# Altium project Kocka_V3.1_ESP.PrjPcb
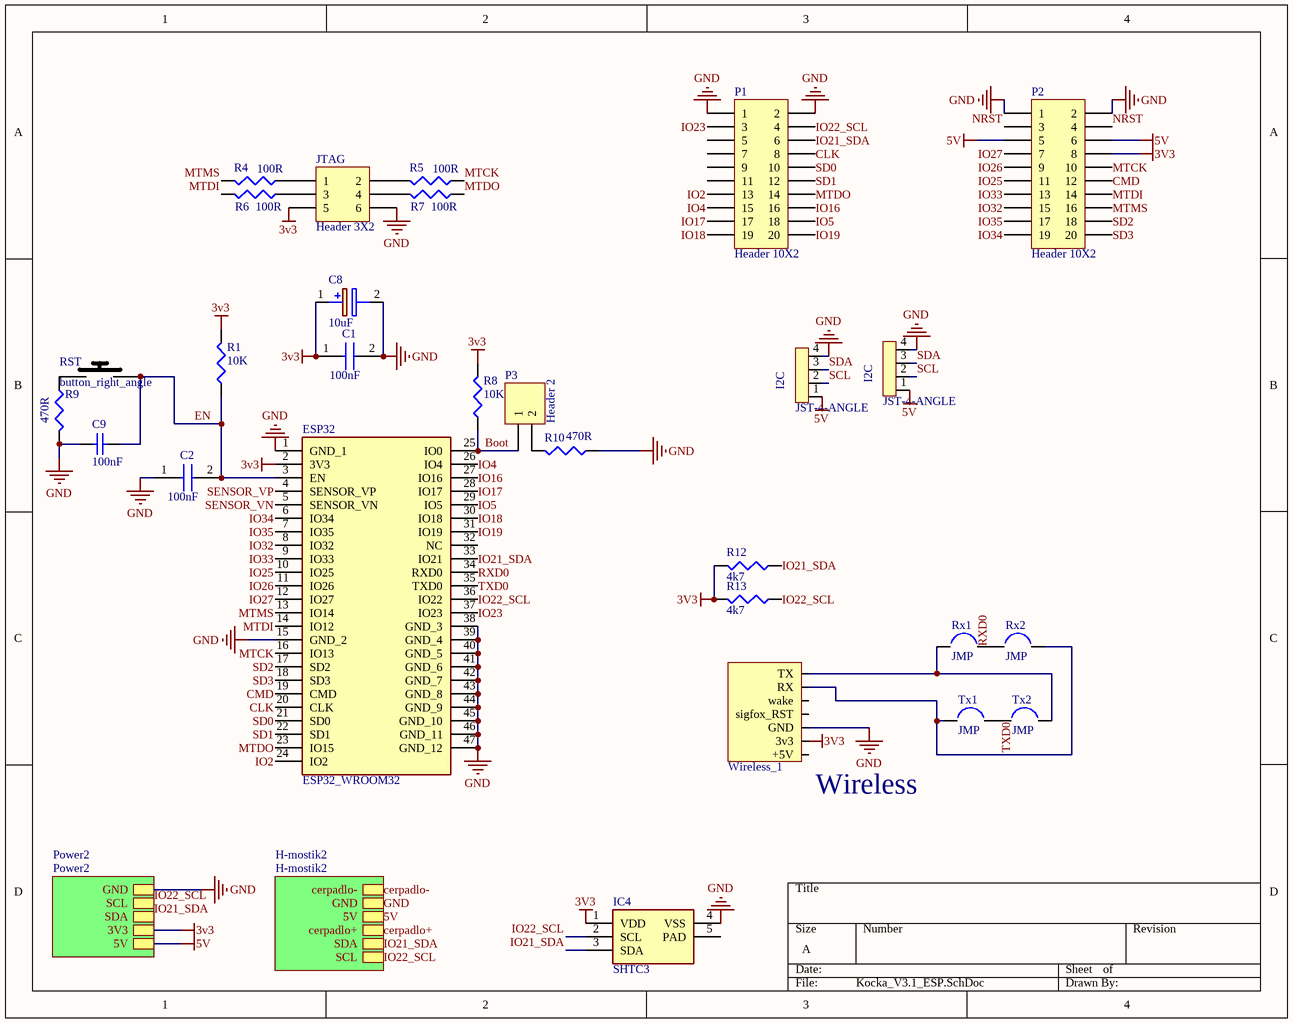
[diagram p0: Kocka_V3.1_ESP.SchDoc]
3 sheets, 53 parts. Net scope: hierarchical (ports join the sheet entries above them; power ports are global).
Board files: Kocka_V3.1_ESP.PcbDoc, Kocka_V3.1_ESP_panel.PcbDoc
Sheets:
  Kocka_V3.1_ESP.SchDoc
    H-mostik2 = H-mostik2.SchDoc
    Power2 = Power2.SchDoc

## Sheet Kocka_V3.1_ESP.SchDoc
size A

### Parts
(Parts that share a designator on the sheet are numbered #1, #2 ... from top to bottom, then left to right.)
C1  100nF  [CAPC1608X90N]
C2  100nF  [CAPC1608X90N]
C8  10uF  [CAPPM3216X180N]
C9  100nF  [1608[0603]]
ESP32  ESP32_WROOM32  [ESP32WROOM32]
I2C#1  JST-4-ANGLE  [JST-4-ANGLE]
I2C#2  JST-4-ANGLE  [JST-4-ANGLE]
IC4  SHTC3  [SHTC3]
JTAG  Header 3X2  [HDR2X3]
P1  Header 10X2  [HDR2X10]
P2  Header 10X2  [HDR2X10]
P3  Header 2  [HDR1X2]
R1  10K  [J1-0603]
R4  100R  [J1-0603]
R5  100R  [J1-0603]
R6  100R  [J1-0603]
R7  100R  [J1-0603]
R8  10K  [J1-0603]
R9  470R  [J1-0603]
R10  470R  [J1-0603]
R12  4k7  [J1-0603]
R13  4k7  [J1-0603]
RST  button_right_angle  [1825027-8]
Rx1  JMP  [JMP]
Rx2  JMP  [JMP]
Tx1  JMP  [JMP]
Tx2  JMP  [JMP]
Wireless_1  header7  [Wireless]  (value not drawn)

### Sub-sheets
H-mostik2 = H-mostik2: 5V, SCL, GND, SDA, cerpadlo+, cerpadlo-
Power2 = Power2: 3V3, SCL, SDA, 5V, GND

### Nets
3v3: C1.1 C8.1(+) ESP32.2(3V3) IC4.1(VDD) JTAG.5 P2.8 R1.2 R8.2 R12.2 R13.2 Wireless_1.2(3v3) ; sheet Power2/3V3
5V: I2C#1.1 I2C#2.1 P2.5 P2.6 ; sheet H-mostik2/5V, sheet Power2/5V
GND: C1.2 C2.1 C8.2(-) C9.1 ESP32.1(GND_1) ESP32.15(GND_2) ESP32.38(GND_3) ESP32.39(GND_4) ESP32.40(GND_5) ESP32.41(GND_6) ESP32.42(GND_7) ESP32.43(GND_8) ESP32.44(GND_9) ESP32.45(GND_10) ESP32.46(GND_11) ESP32.47(GND_12) I2C#1.4 I2C#2.4 IC4.4(VSS) JTAG.6 P1.1 P1.2 P2.1 P2.2 R9.2 R10.1 Wireless_1.3(GND) ; sheet H-mostik2/GND, sheet Power2/GND
Boot: ESP32.25(IO0) P3.1 R8.1
CLK: ESP32.20(CLK) P1.8
CMD: ESP32.19(CMD) P2.12
EN: C2.2 C9.2 ESP32.3(EN) R1.1 RST.2
IO2: ESP32.24(IO2) P1.13
IO4: ESP32.26(IO4) P1.15
IO5: ESP32.29(IO5) P1.18
IO16: ESP32.27(IO16) P1.16
IO17: ESP32.28(IO17) P1.17
IO18: ESP32.30(IO18) P1.19
IO19: ESP32.31(IO19) P1.20
IO21_SDA: ESP32.33(IO21) IC4.3(SDA) P1.6 R12.1 ; sheet H-mostik2/SDA, sheet Power2/SDA
IO22_SCL: ESP32.36(IO22) IC4.2(SCL) P1.4 R13.1 ; sheet H-mostik2/SCL, sheet Power2/SCL
IO23: ESP32.37(IO23) P1.3
IO25: ESP32.10(IO25) P2.11
IO26: ESP32.11(IO26) P2.9
IO27: ESP32.12(IO27) P2.7
IO32: ESP32.8(IO32) P2.15
IO33: ESP32.9(IO33) P2.13
IO34: ESP32.6(IO34) P2.19
IO35: ESP32.7(IO35) P2.17
MTCK: ESP32.16(IO13) P2.10 R5.1
MTDI: ESP32.14(IO12) P2.14 R6.2
MTDO: ESP32.23(IO15) P1.14 R7.1
MTMS: ESP32.13(IO14) P2.16 R4.2
NRST: P2.3 P2.4
RXD0: ESP32.34(RXD0) Rx1.2 Rx2.1
SCL: I2C#1.2 I2C#2.2
SD0: ESP32.21(SD0) P1.10
SD1: ESP32.22(SD1) P1.12
SD2: ESP32.17(SD2) P2.18
SD3: ESP32.18(SD3) P2.20
SDA: I2C#1.3 I2C#2.3
SENSOR_VN: ESP32.5(SENSOR_VN)
SENSOR_VP: ESP32.4(SENSOR_VP)
TXD0: ESP32.35(TXD0) Tx1.2 Tx2.1
NetJTAG_1: JTAG.1 R4.1
NetJTAG_2: JTAG.2 R5.2
NetJTAG_3: JTAG.3 R6.1
NetJTAG_4: JTAG.4 R7.2
NetP3_2: P3.2 R10.2
NetR9_1: R9.1 RST.1
NetRx1_1: Rx1.1 Tx2.2 Wireless_1.7(TX)
NetRx2_2: Rx2.2 Tx1.1 Wireless_1.6(RX)

Not connected (* = marked no-connect by the designer): ESP32 32(NC); IC4 5(PAD); P1 5 7 9 11; Wireless_1 1(+5V) 4(sigfox_RST) 5(wake)

### Notes on the sheet
- (near Wireless_1) Wireless

### Library data of the parts
C1 C2 = 06033D225MAT2A: Capacitor; Manufacturer_Name: AVX; Datasheet Link: https://componentsearchengine.com/Datasheets/1/06031A100FAT2A.pdf; Height: 0.9mm; Manufacturer_Part_Number: 06033D225MAT2A; Mouser Part Number: 581-06033D225MAT2A; Mouser Price/Stock: https://www.mouser.co.uk/ProductDetail/AVX/06033D225MAT2A?qs=%252BdQmOuGyFcGllV0VA4zyxA%3D%3D
C8 = TAJA106K004RNJ: Capacitor Polarised; Manufacturer_Name: AVX; Datasheet Link: http://www.farnell.com/datasheets/1680476.pdf; Height: 1.8mm; Manufacturer_Part_Number: TAJA106K004RNJ; Mouser Part Number: 581-TAJA106K004R; Mouser Price/Stock: https://www.mouser.com/Search/Refine.aspx?Keyword=581-TAJA106K004R
C9 = Cap Semi: Capacitor; Value: 100pF; Published: 8-Jun-2000; LatestRevisionDate: 29-May-2009; LatestRevisionNote: IPC-7351 Footprint Added.; PackageReference: C1206; Publisher: Altium Limited; PackageDescription: Chip Capacitor
ESP32 = ESP32_WROOM32: Integrated Circuit; Manufacturer_Name: Espressif Systems; Manufacturer_Part_Number: ESP32 WROOM32; Datasheet Link: https://www.espressif.com/sites/default/files/documentation/esp32-wroom-32_datasheet_en.pdf; Height: 3.2mm
I2C#1 I2C#2 = JST-4-ANGLE: NXW-04K
IC4 = SHTC3: Integrated Circuit; Manufacturer_Name: Sensirion; Datasheet Link: https://www.glynshop.com/erp/owweb/Daten/Datenblaetter/Sensirion/SHTC3.pdf; Height: 0mm; Manufacturer_Part_Number: SHTC3; Mouser Part Number: 403-SHTC3; Mouser Price/Stock: https://www.mouser.com/Search/Refine.aspx?Keyword=403-SHTC3
JTAG = Header 3X2: Header, 3-Pin, Dual row; LatestRevisionDate: 17-Jul-2002; LatestRevisionNote: Re-released for DXP Platform.; Publisher: Altium Limited
P1 P2 = Header 10X2: Header, 10-Pin, Dual row; LatestRevisionDate: 17-Jul-2002; LatestRevisionNote: Re-released for DXP Platform.; Publisher: Altium Limited
P3 = Header 2: Header, 2-Pin; LatestRevisionDate: 17-Jul-2002; LatestRevisionNote: Re-released for DXP Platform.; Publisher: Altium Limited
R1 R4-R10 = Res3: Resistor; Published: 8-Jun-2000; LatestRevisionDate: 29-May-2009; LatestRevisionNote: IPC-7351 Footprint Added.; PackageReference: J1-0603; Publisher: Altium Limited; PackageDescription: Chip Resistor
  R1 R8: Value: 10K
  R4-R7: Value: 100R
  R9 R10: Value: 470R
R12 R13 = Res3: Resistor; Value: 1K5; Published: 8-Jun-2000; LatestRevisionDate: 29-May-2009; LatestRevisionNote: IPC-7351 Footprint Added.; PackageReference: J1-0603; Publisher: Altium Limited; PackageDescription: Chip Resistor
RST = button_right_angle: Switch; Manufacturer_Name: TE Connectivity; Datasheet Link: http://www.te.com/commerce/DocumentDelivery/DDEController?Action=srchrtrv&DocNm=1825027&DocType=Customer+Drawing&DocLang=English; Manufacturer_Part_Number: 1825027-8; Mouser Part Number: 506-1825027-8; Mouser Price/Stock: https://www.mouser.com/Search/Refine.aspx?Keyword=506-1825027-8; RS Part Number: 7182389P; RS Price/Stock: http://uk.rs-online.com/web/p/products/7182389P
Wireless_1 = Wireless

## Sheet H-mostik2.SchDoc
size A
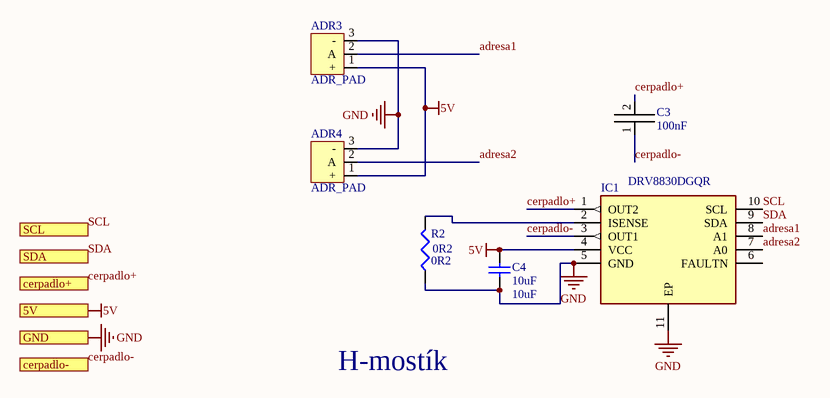
[diagram p1: H-mostik2.SchDoc]

### Parts
ADR3  ADR_PAD  [SOLDER_PAD]
ADR4  ADR_PAD  [SOLDER_PAD]
C3  100nF  [Capacitor]
C4  10uF  [C2512]
IC1  DRV8830DGQR  [SOP50P490X110-11N]
R2  0R2  [J1-0603]

### Ports
5V, cerpadlo+, cerpadlo-, GND, SCL, SDA

### Nets
5V: ADR3.1(+) ADR4.1(+) C4.2 IC1.4(VCC) ; port 5V
GND: ADR3.3(-) ADR4.3(-) C4.1 IC1.5(GND) IC1.11(EP) R2.1 ; port GND
adresa1: ADR3.2(A) IC1.8(A1)
adresa2: ADR4.2(A) IC1.7(A0)
cerpadlo+: C3.2 IC1.1(OUT2) ; port cerpadlo+
cerpadlo-: C3.1 IC1.3(OUT1) ; port cerpadlo-
SCL: IC1.10(SCL) ; port SCL  [project net IO22_SCL]
SDA: IC1.9(SDA) ; port SDA  [project net IO21_SDA]
NetIC1_2: IC1.2(ISENSE) R2.2

Not connected (* = marked no-connect by the designer): IC1 6(FAULTN)

### Notes on the sheet
- H-mostík

### Library data of the parts
ADR3 ADR4 = ADR_PAD: ADR PAD 3 PIN
C3 = Cap
C4 = Cap Semi: Capacitor (Semiconductor SIM Model); Published: 8-Jun-2000; LatestRevisionDate: 29-May-2009; LatestRevisionNote: IPC-7351 Footprint Added.; PackageReference: C1206; Publisher: Altium Limited; PackageDescription: Chip Capacitor; Value: 10uF
IC1 = DRV8830DGQR: Integrated Circuit; Manufacturer_Name: Texas Instruments; Datasheet Link: http://www.ti.com/lit/ds/symlink/drv8830.pdf; Height: 1.1mm; Manufacturer_Part_Number: DRV8830DGQR; Mouser Part Number: 595-DRV8830DGQR; Mouser Price/Stock: https://www.mouser.com/Search/Refine.aspx?Keyword=595-DRV8830DGQR; RS Part Number: 1626149; RS Price/Stock: http://uk.rs-online.com/web/p/products/1626149
R2 = Res3: Resistor; Published: 8-Jun-2000; LatestRevisionDate: 29-May-2009; LatestRevisionNote: IPC-7351 Footprint Added.; PackageReference: J1-0603; Publisher: Altium Limited; PackageDescription: Chip Resistor; Value: 0R2

## Sheet Power2.SchDoc
size A
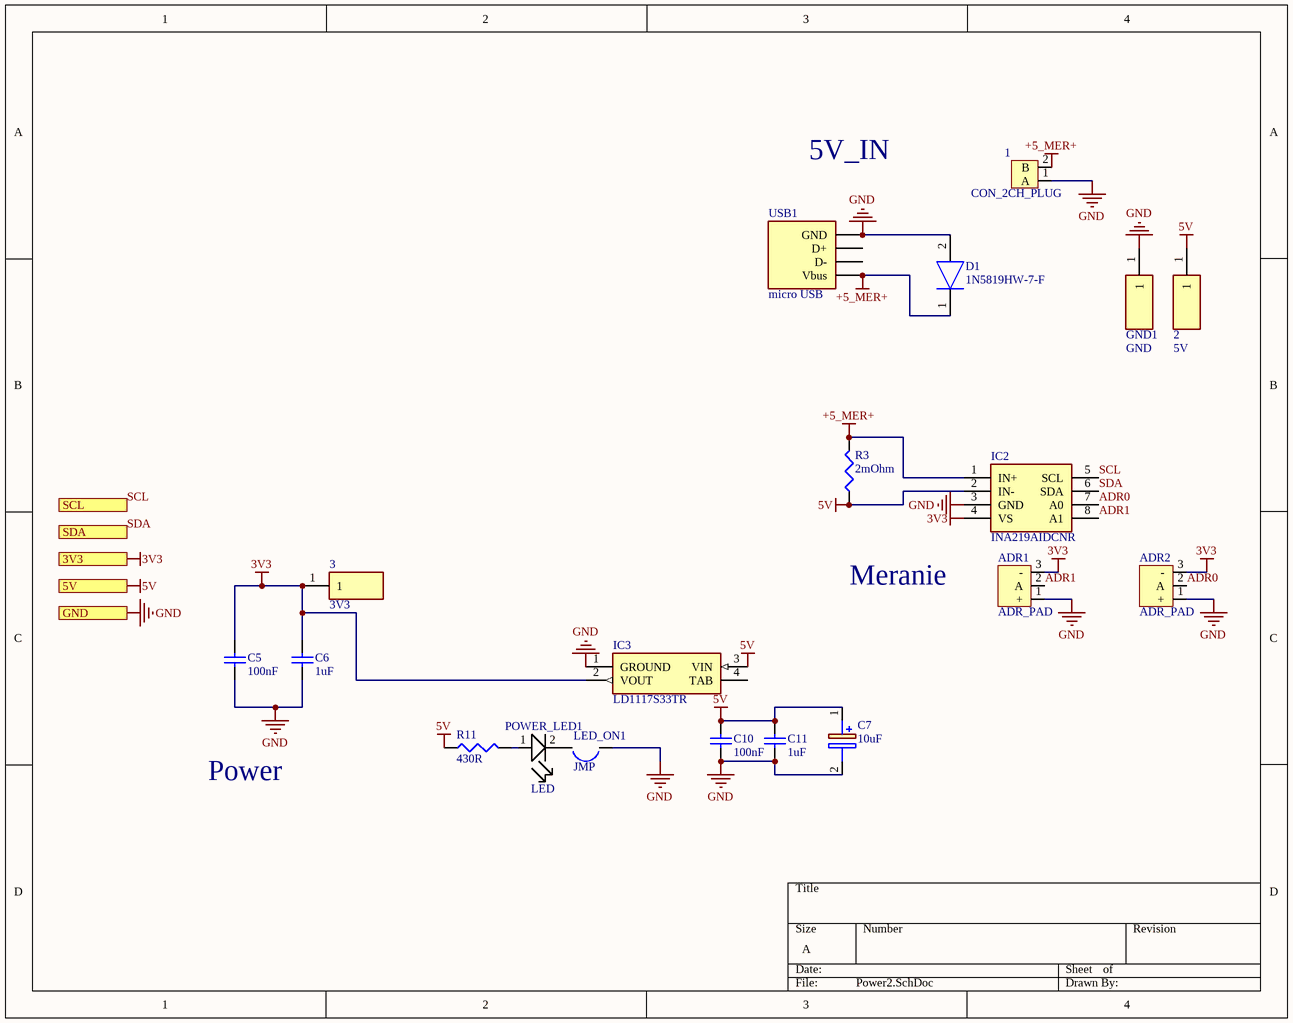
[diagram p2: Power2.SchDoc]

### Parts
1  CON_2CH_PLUG  [CON_2CH_PLUG]
2  5V  [1508000150000030]
3  3V3  [1508000150000030]
ADR1  ADR_PAD  [SOLDER_PAD]
ADR2  ADR_PAD  [SOLDER_PAD]
C5  100nF  [1608[0603]]
C6  1uF  [1608[0603]]
C7  10uF  [CAPPM3216X180N]
C10  100nF  [1608[0603]]
C11  1uF  [1608[0603]]
D1  1N5819HW-7-F  [SOD3716X145N]
GND1  GND  [1508000150000030]
IC2  INA219AIDCNR  [SOT65P280X145-8N]
IC3  LD1117S33TR  [SOT230P700X180-4N]
LED_ON1  JMP  [JMP]
POWER_LED1  LED  [LED5mA]
R3  2mOhm  [RESC3216X75N]
R11  430R  [J1-0603]
USB1  micro USB  [micro USB]

### Ports
3V3, 5V, GND, SCL, SDA

### Nets
3v3: 3.1 ADR1.3(-) ADR2.3(-) C5.1 C6.1 IC2.4(VS) IC3.2(VOUT) ; port 3V3
5V: 2.1 C7.1(+) C10.1 C11.1 IC2.2(IN-) IC3.3(VIN) R3.1 R11.1 ; port 5V
+5_MER+: 1.2(B) D1.1(K) IC2.1(IN+) R3.2 USB1.1(Vbus)
GND: 1.1(A) ADR1.1(+) ADR2.1(+) C5.2 C6.2 C7.2(-) C10.2 C11.2 D1.2(A) GND1.1 IC2.3(GND) IC3.1(GROUND) LED_ON1.1 USB1.5(GND) ; port GND
ADR0: ADR2.2(A) IC2.7(A0)
ADR1: ADR1.2(A) IC2.8(A1)
SCL: IC2.5(SCL) ; port SCL  [project net IO22_SCL]
SDA: IC2.6(SDA) ; port SDA  [project net IO21_SDA]
NetLED_ON1_2: LED_ON1.2 POWER_LED1.2
NetPOWER_LED1_1: POWER_LED1.1 R11.2

Not connected (* = marked no-connect by the designer): IC3 4(TAB); USB1 2(D-) 3(D+)

### Notes on the sheet
- 5V_IN
- Meranie
- Power

### Library data of the parts
1 = CON_2CH_PLUG: TBG-5.0-KW-2P
2 3 GND1 = 5015: Undefined or Miscellaneous; Manufacturer_Name: Keystone Electronics; Allied_Number: 70182998; Datasheet Link: http://www.keyelco.com/product-pdf.cfm?p=1353; Height: 1.52mm; Manufacturer_Part_Number: 5015; Mouser Part Number: 534-5015; Mouser Price/Stock: https://www.mouser.com/Search/Refine.aspx?Keyword=534-5015; Allied Price/Stock: https://www.alliedelec.com/keystone-electronics-5015/70182998/
ADR1 ADR2 = ADR_PAD: ADR PAD 3 PIN
C5 C6 C11 = Cap Semi: Capacitor; Published: 8-Jun-2000; LatestRevisionDate: 29-May-2009; LatestRevisionNote: IPC-7351 Footprint Added.; PackageReference: C1206; Publisher: Altium Limited; PackageDescription: Chip Capacitor
  C5: Value: 100nF
  C6 C11: Value: 1uF
C7 = TAJA106K004RNJ: as C8 on sheet Kocka_V3.1_ESP; Datasheet Link: http://www.farnell.com/datasheets/1680476.pdf; Height: 1.8mm; Manufacturer_Part_Number: TAJA106K004RNJ; Mouser Part Number: 581-TAJA106K004R; Mouser Price/Stock: https://www.mouser.com/Search/Refine.aspx?Keyword=581-TAJA106K004R
C10 = Cap Semi: Capacitor; Value: 100pF; Published: 8-Jun-2000; LatestRevisionDate: 29-May-2009; LatestRevisionNote: IPC-7351 Footprint Added.; PackageReference: C1206; Publisher: Altium Limited; PackageDescription: Chip Capacitor
D1 = 1N5819HW-7-F: Diode; Manufacturer_Name: Diodes Inc.; Datasheet Link: http://www.diodes.com/_files/datasheets/ds30217.pdf; Height: 1.45mm; Manufacturer_Part_Number: 1N5819HW-7-F; Arrow Part Number: 1N5819HW-7-F; Arrow Price/Stock: https://www.arrow.com/en/products/1n5819hw-7-f/diodes-incorporated; Mouser Part Number: 621-1N5819HW-F; Mouser Price/Stock: https://www.mouser.co.uk/ProductDetail/Diodes-Incorporated/1N5819HW-7-F?qs=NQ47qNm99eDyWTEd07miYA%3D%3D
IC2 = INA219BIDCNR: Integrated Circuit; Manufacturer_Name: Texas Instruments; Datasheet Link: http://www.ti.com/lit/ds/symlink/ina219.pdf; Height: 1.45mm; Manufacturer_Part_Number: INA219BIDCNR; Mouser Part Number: 595-INA219BIDCNR; Mouser Price/Stock: https://www.mouser.com/Search/Refine.aspx?Keyword=595-INA219BIDCNR
IC3 = LD1117S33TR: Integrated Circuit; Manufacturer_Name: STMicroelectronics; Allied_Number: 70390201; Datasheet Link: http://www.st.com/st-web-ui/static/active/en/resource/technical/document/datasheet/CD00000544.pdf; Height: 1.8mm; Manufacturer_Part_Number: LD1117S33TR; Mouser Part Number: 511-LD1117S33; Mouser Price/Stock: https://www.mouser.com/Search/Refine.aspx?Keyword=511-LD1117S33; RS Part Number: 7140697P; RS Price/Stock: http://uk.rs-online.com/web/p/products/7140697P; Allied Price/Stock: http://www.alliedelec.com/stmicroelectronics-ld1117s33tr/70390201/
R3 R11 = Res3: Resistor; Published: 8-Jun-2000; LatestRevisionDate: 29-May-2009; LatestRevisionNote: IPC-7351 Footprint Added.; PackageReference: J1-0603; Publisher: Altium Limited; PackageDescription: Chip Resistor
  R3: Value: 2mOhm
  R11: Value: 430R

## Nets that join several sheets
3v3: Kocka_V3.1_ESP (11 pins), Power2 (7 pins)
5V: Kocka_V3.1_ESP (I2C#1.1 I2C#2.1 P2.5 P2.6), H-mostik2 (ADR3.1 ADR4.1 C4.2 IC1.4), Power2 (8 pins)
GND: Kocka_V3.1_ESP (27 pins), H-mostik2 (6 pins), Power2 (14 pins)
IO21_SDA: Kocka_V3.1_ESP (ESP32.33 IC4.3 P1.6 R12.1), H-mostik2 (IC1.9), Power2 (IC2.6)
IO22_SCL: Kocka_V3.1_ESP (ESP32.36 IC4.2 P1.4 R13.1), H-mostik2 (IC1.10), Power2 (IC2.5)